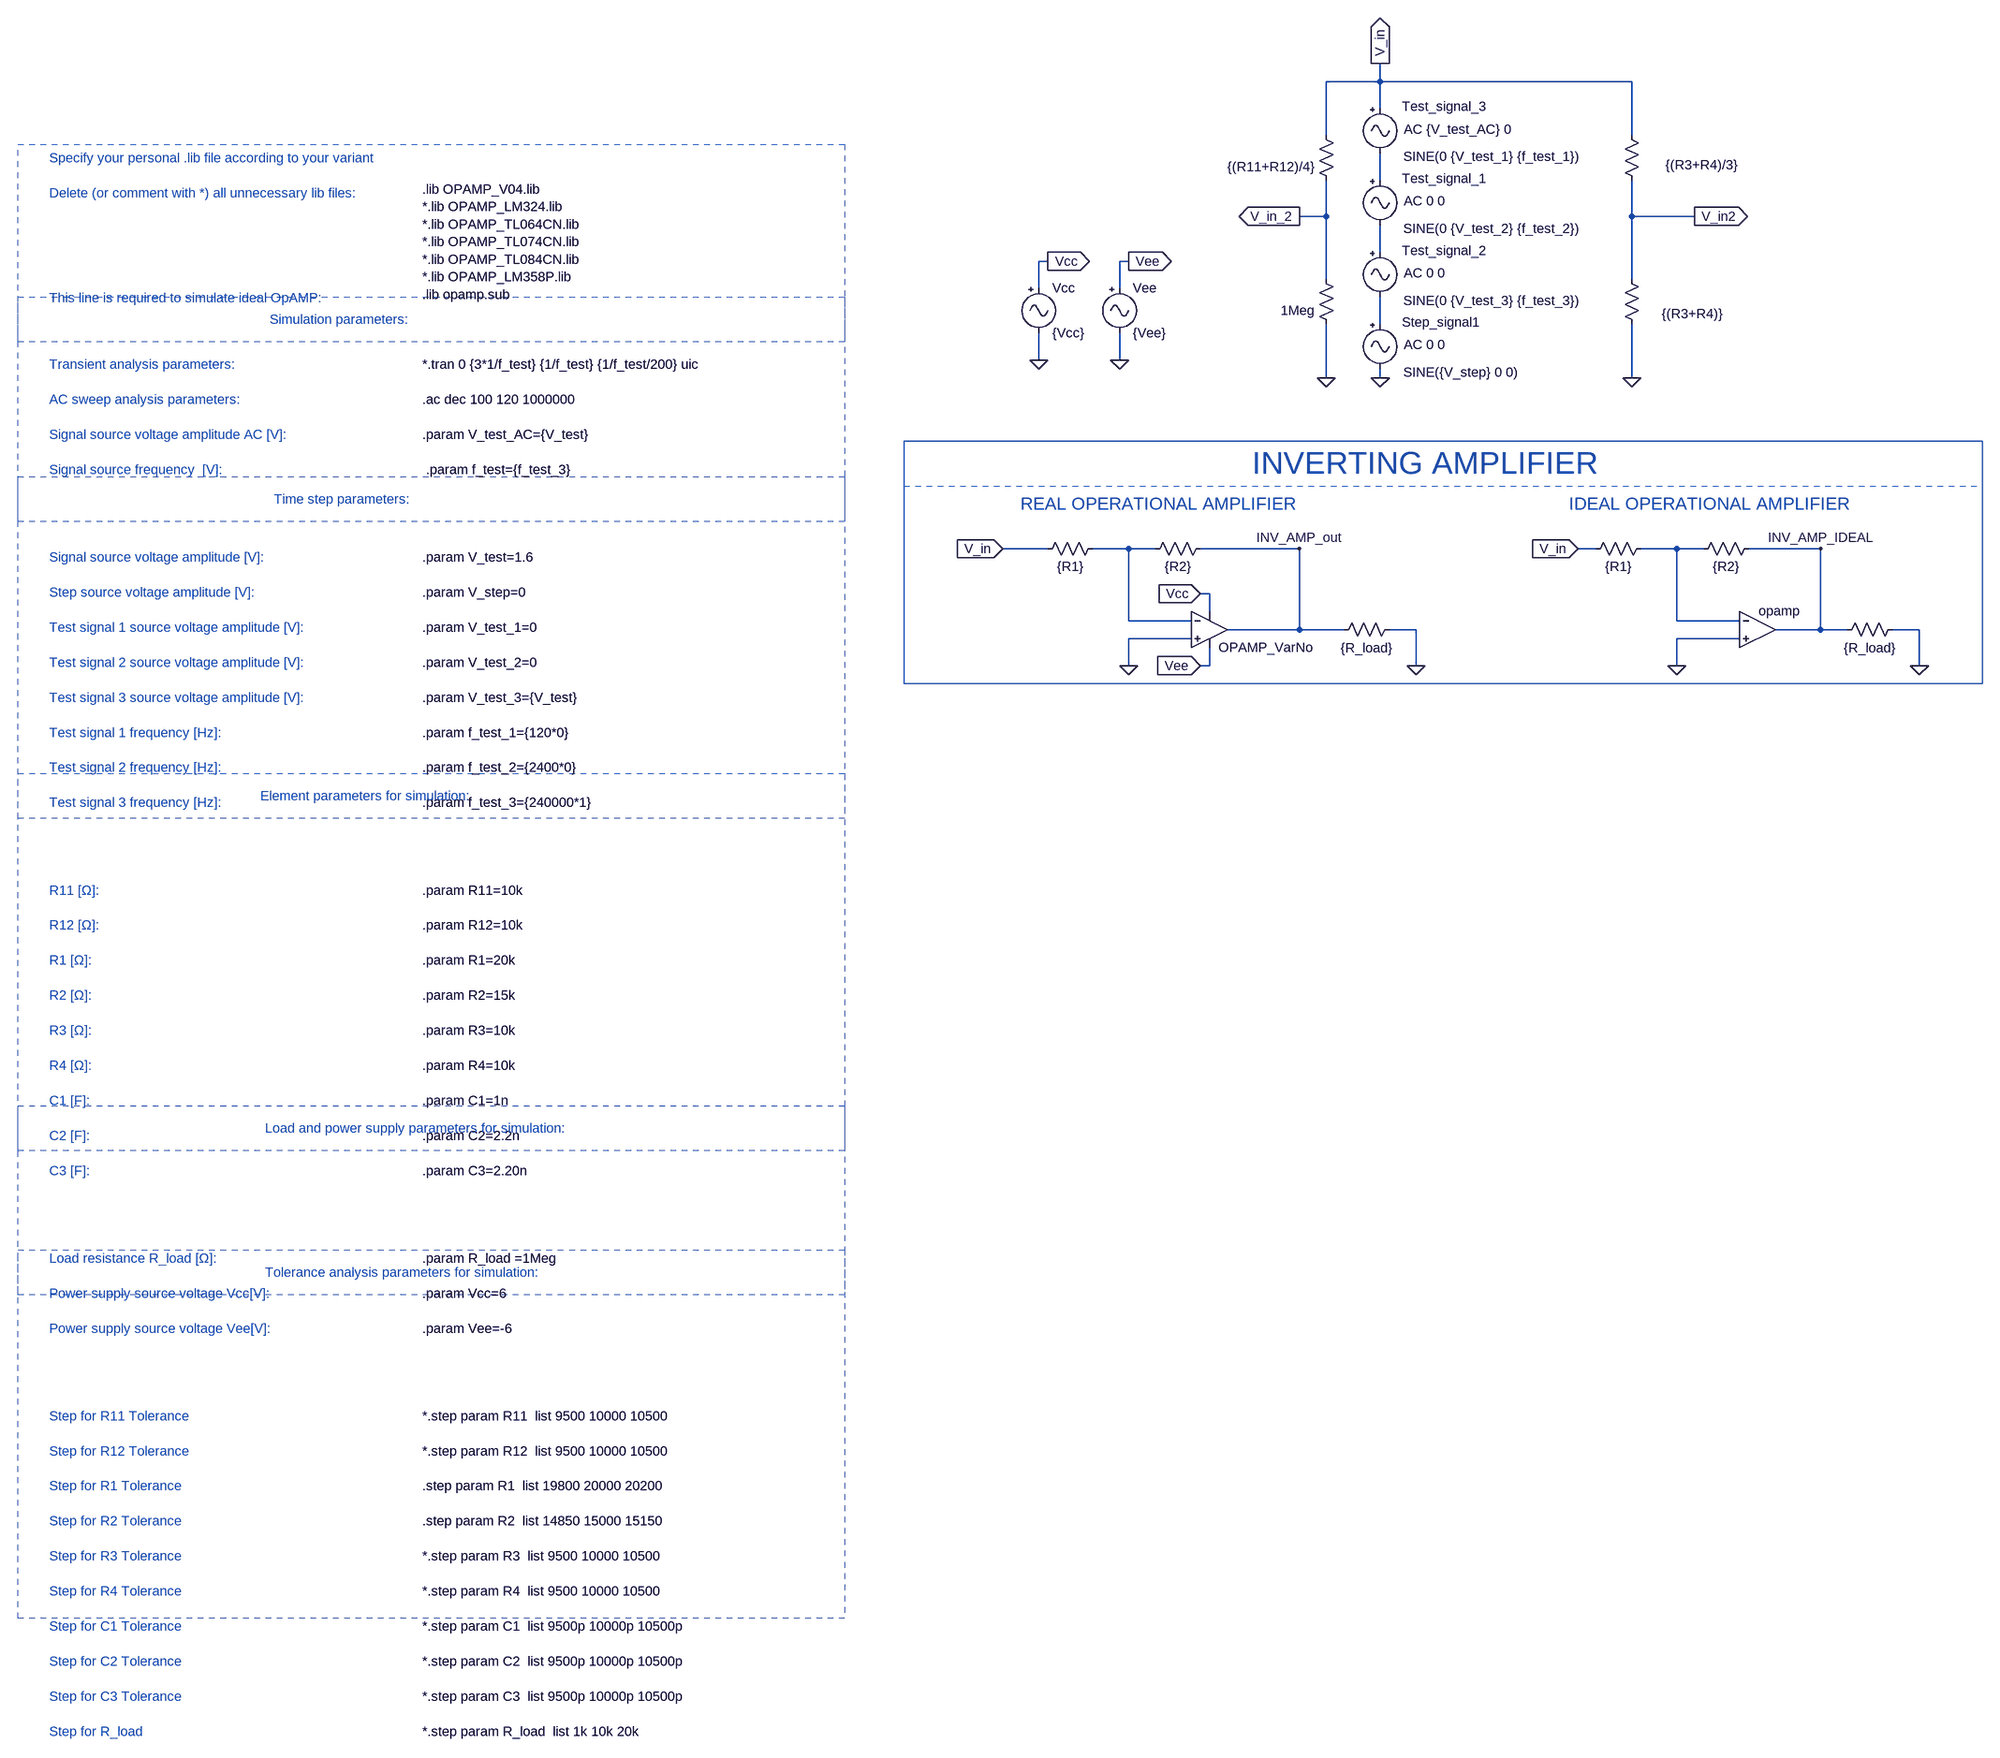
[diagram p0: schematic Lab2. OpAmp_lx.asc]
Lab2. OpAmp_lx.asc, the LTspice schematic file:
Version 4
SHEET 1 3472 3556
WIRE 608 -1040 608 -1072
WIRE 608 -1040 512 -1040
WIRE 1056 -1040 608 -1040
WIRE 608 -992 608 -1040
WIRE 512 -944 512 -1040
WIRE 1056 -944 1056 -1040
WIRE 608 -864 608 -912
WIRE 512 -800 512 -864
WIRE 512 -800 464 -800
WIRE 1056 -800 1056 -864
WIRE 1168 -800 1056 -800
WIRE 608 -736 608 -784
WIRE 16 -720 0 -720
WIRE 160 -720 144 -720
WIRE 512 -688 512 -800
WIRE 1056 -688 1056 -800
WIRE 0 -672 0 -720
WIRE 144 -672 144 -720
WIRE 608 -608 608 -656
WIRE 0 -544 0 -592
WIRE 144 -544 144 -592
WIRE 512 -512 512 -608
WIRE 608 -512 608 -528
WIRE 1056 -512 1056 -608
WIRE 16 -208 -64 -208
WIRE 160 -208 96 -208
WIRE 208 -208 160 -208
WIRE 464 -208 288 -208
WIRE 992 -208 960 -208
WIRE 1136 -208 1072 -208
WIRE 1184 -208 1136 -208
WIRE 1392 -208 1264 -208
WIRE 304 -128 288 -128
WIRE 304 -96 304 -128
WIRE 160 -80 160 -208
WIRE 272 -80 160 -80
WIRE 1136 -80 1136 -208
WIRE 1248 -80 1136 -80
WIRE 464 -64 464 -208
WIRE 464 -64 336 -64
WIRE 544 -64 464 -64
WIRE 672 -64 624 -64
WIRE 1392 -64 1392 -208
WIRE 1392 -64 1312 -64
WIRE 1440 -64 1392 -64
WIRE 1568 -64 1520 -64
WIRE 272 -48 160 -48
WIRE 1248 -48 1136 -48
WIRE 160 0 160 -48
WIRE 304 0 304 -32
WIRE 304 0 288 0
WIRE 672 0 672 -64
WIRE 1136 0 1136 -48
WIRE 1568 0 1568 -64
FLAG 160 0 0
FLAG 288 -128 Vcc
IOPIN 288 -128 In
FLAG 288 0 Vee
IOPIN 288 0 In
FLAG 464 -208 INV_AMP_out
FLAG -64 -208 V_in
IOPIN -64 -208 In
FLAG 1136 0 0
FLAG 1392 -208 INV_AMP_IDEAL
FLAG 960 -208 V_in
IOPIN 960 -208 In
FLAG 672 0 0
FLAG 1568 0 0
FLAG 0 -544 0
FLAG 144 -544 0
FLAG 16 -720 Vcc
IOPIN 16 -720 Out
FLAG 160 -720 Vee
IOPIN 160 -720 Out
FLAG 608 -512 0
FLAG 608 -1072 V_in
IOPIN 608 -1072 Out
FLAG 464 -800 V_in_2
IOPIN 464 -800 Out
FLAG 512 -512 0
FLAG 1056 -512 0
FLAG 1168 -800 V_in2
IOPIN 1168 -800 Out
SYMBOL OpAmps\\opamp2 304 -128 R0
WINDOW 0 16 32 Invisible 2
SYMATTR InstName U1
SYMATTR Value OPAMP_VarNo
SYMBOL res 112 -224 R90
WINDOW 0 0 56 Invisible 2
WINDOW 3 32 56 VTop 2
SYMATTR InstName R1
SYMATTR Value {R1}
SYMATTR SpiceLine tol=10
SYMBOL res 304 -224 R90
WINDOW 0 0 56 Invisible 2
WINDOW 3 32 56 VTop 2
SYMATTR InstName R2
SYMATTR Value {R2}
SYMBOL res 1088 -224 R90
WINDOW 0 0 56 Invisible 2
WINDOW 3 32 56 VTop 2
SYMATTR InstName Ri1
SYMATTR Value {R1}
SYMATTR SpiceLine tol=10
SYMBOL res 1280 -224 R90
WINDOW 0 0 56 Invisible 2
WINDOW 3 32 56 VTop 2
SYMATTR InstName Ri2
SYMATTR Value {R2}
SYMBOL OpAmps\\opamp 1280 -128 R0
WINDOW 0 0 32 Invisible 2
WINDOW 3 2 31 Left 2
SYMATTR InstName U2
SYMBOL res 640 -80 R90
WINDOW 0 0 56 Invisible 2
WINDOW 3 33 56 VTop 2
SYMATTR InstName R5
SYMATTR Value {R_load}
SYMBOL res 1536 -80 R90
WINDOW 0 0 56 Invisible 2
WINDOW 3 33 56 VTop 2
SYMATTR InstName R7
SYMATTR Value {R_load}
SYMBOL Misc\\signal 144 -688 R0
WINDOW 123 0 0 Left 0
WINDOW 39 0 0 Left 0
SYMATTR InstName Vee
SYMATTR Value {Vee}
SYMBOL Misc\\signal 0 -688 R0
WINDOW 123 0 0 Left 0
WINDOW 39 0 0 Left 0
SYMATTR InstName Vcc
SYMATTR Value {Vcc}
SYMBOL Misc\\signal 608 -624 R0
WINDOW 123 42 53 Left 2
WINDOW 39 0 0 Left 0
WINDOW 0 39 13 Left 2
WINDOW 3 41 102 Left 2
SYMATTR Value2 AC 0 0
SYMATTR InstName Step_signal1
SYMATTR Value SINE({V_step} 0 0)
SYMBOL Misc\\signal 608 -880 R0
WINDOW 123 42 53 Left 2
WINDOW 39 0 0 Left 0
WINDOW 0 39 13 Left 2
WINDOW 3 41 102 Left 2
SYMATTR Value2 AC 0 0
SYMATTR InstName Test_signal_1
SYMATTR Value SINE(0 {V_test_2} {f_test_2})
SYMBOL Misc\\signal 608 -752 R0
WINDOW 123 42 53 Left 2
WINDOW 39 0 0 Left 0
WINDOW 0 39 13 Left 2
WINDOW 3 41 102 Left 2
SYMATTR Value2 AC 0 0
SYMATTR InstName Test_signal_2
SYMATTR Value SINE(0 {V_test_3} {f_test_3})
SYMBOL Misc\\signal 608 -1008 R0
WINDOW 123 42 53 Left 2
WINDOW 39 0 0 Left 0
WINDOW 0 39 13 Left 2
WINDOW 3 41 102 Left 2
SYMATTR Value2 AC {V_test_AC} 0
SYMATTR InstName Test_signal_3
SYMATTR Value SINE(0 {V_test_1} {f_test_1})
SYMBOL res 528 -848 R180
WINDOW 0 36 76 Invisible 2
WINDOW 3 36 40 Left 2
SYMATTR InstName R13
SYMATTR Value {(R11+R12)/4}
SYMBOL res 528 -592 R180
WINDOW 0 36 76 Invisible 2
WINDOW 3 36 40 Left 2
SYMATTR InstName R14
SYMATTR Value 1Meg
SYMBOL res 1072 -848 R180
WINDOW 0 -49 76 Invisible 2
WINDOW 3 -173 43 Left 2
SYMATTR InstName R15
SYMATTR Value {(R3+R4)/3}
SYMBOL res 1072 -592 R180
WINDOW 0 -52 66 Invisible 2
WINDOW 3 -146 34 Left 2
SYMATTR InstName R16
SYMATTR Value {(R3+R4)}
TEXT 944 -288 Left 3 ;IDEAL OPERATIONAL AMPLIFIER
TEXT -32 -288 Left 3 ;REAL OPERATIONAL AMPLIFIER
TEXT 688 -360 Center 5 ;INVERTING AMPLIFIER
TEXT -1104 -536 Left 2 !*.tran 0 {3*1/f_test} {1/f_test} {1/f_test/200} uic\n  \n.ac dec 100 120 1000000\n \n.param V_test_AC={V_test}\n \n .param f_test={f_test_3}\n \n \n \n \n.param V_test=1.6\n \n.param V_step=0\n \n.param V_test_1=0\n \n.param V_test_2=0\n \n.param V_test_3={V_test}\n \n.param f_test_1={120*0}\n \n.param f_test_2={2400*0}\n \n.param f_test_3={240000*1}\n \n \n  \n \n.param R11=10k\n  \n.param R12=10k\n \n.param R1=20k\n \n.param R2=15k\n \n.param R3=10k\n \n.param R4=10k\n \n.param C1=1n\n \n.param C2=2.2n\n \n.param C3=2.20n\n \n \n \n \n.param R_load =1Meg\n \n.param Vcc=6\n \n.param Vee=-6\n \n \n \n  \n*.step param R11  list 9500 10000 10500 \n \n*.step param R12  list 9500 10000 10500 \n  \n.step param R1  list 19800 20000 20200 \n \n.step param R2  list 14850 15000 15150\n \n*.step param R3  list 9500 10000 10500\n \n*.step param R4  list 9500 10000 10500\n \n*.step param C1  list 9500p 10000p 10500p\n \n*.step param C2  list 9500p 10000p 10500p\n \n*.step param C3  list 9500p 10000p 10500p\n \n*.step param R_load  list 1k 10k 20k
TEXT -1104 -848 Left 2 !.lib OPAMP_V04.lib\n*.lib OPAMP_LM324.lib\n*.lib OPAMP_TL064CN.lib\n*.lib OPAMP_TL074CN.lib\n*.lib OPAMP_TL084CN.lib\n*.lib OPAMP_LM358P.lib \n.lib opamp.sub
TEXT -1768 -904 Left 2 ;Specify your personal .lib file according to your variant\n \nDelete (or comment with *) all unnecessary lib files:\n \n \n \n  \n \nThis line is required to simulate ideal OpAMP:
TEXT -1376 -616 Left 2 ;Simulation parameters:
TEXT -1392 232 Left 2 ;Element parameters for simulation:
TEXT -1768 -536 Left 2 ;Transient analysis parameters:\n \nAC sweep analysis parameters:\n \nSignal source voltage amplitude AC [V]: \n \nSignal source frequency  [V]:  \n \n \n \n \nSignal source voltage amplitude [V]:\n \nStep source voltage amplitude [V]:\n \nTest signal 1 source voltage amplitude [V]:\n \nTest signal 2 source voltage amplitude [V]:\n \nTest signal 3 source voltage amplitude [V]:\n \nTest signal 1 frequency [Hz]:\n \nTest signal 2 frequency [Hz]:\n \nTest signal 3 frequency [Hz]:\n \n \n  \n  \nR11 [Ω]:\n \nR12 [Ω]:\n \nR1 [Ω]:\n \nR2 [Ω]:\n \nR3 [Ω]:\n \nR4 [Ω]:\n \nC1 [F]:\n \nC2 [F]:\n \nC3 [F]:\n \n \n \n \nLoad resistance R_load [Ω]:\n \nPower supply source voltage Vcc[V]:\n \nPower supply source voltage Vee[V]: \n \n \n \n \nStep for R11 Tolerance\n \nStep for R12 Tolerance \n \nStep for R1 Tolerance\n \nStep for R2 Tolerance\n \nStep for R3 Tolerance\n \nStep for R4 Tolerance \n \nStep for C1 Tolerance \n \nStep for C2 Tolerance\n \nStep for C3 Tolerance \n \nStep for R_load
TEXT -1368 -296 Left 2 ;Time step parameters:
TEXT -1384 824 Left 2 ;Load and power supply parameters for simulation:
TEXT -1384 1080 Left 2 ;Tolerance analysis parameters for simulation:
RECTANGLE Normal 1680 32 -240 -320 2
RECTANGLE Normal 1680 32 -240 -400
RECTANGLE Normal -352 -576 -1824 -656 2
RECTANGLE Normal -352 272 -1824 192 2
RECTANGLE Normal -352 864 -1824 784 2
RECTANGLE Normal -352 -256 -1824 -336 2
RECTANGLE Normal -352 1120 -1824 1040 2
RECTANGLE Normal -352 1696 -1824 -928 2

The netlist it stands for:
* Lab2. OpAmp_lx.asc
XU1 0 N004 Vcc Vee INV_AMP_out OPAMP_VarNo  ; pins In+ In- V+ V- OUT
R1 N004 V_in {R1} tol=10
R2 INV_AMP_out N004 {R2}
Ri1 N005 V_in {R1} tol=10
Ri2 INV_AMP_IDEAL N005 {R2}
XU2 N005 0 INV_AMP_IDEAL opamp Aol=100K GBW=10Meg  ; pins invin noninvin out
R5 0 INV_AMP_out {R_load}
R7 0 INV_AMP_IDEAL {R_load}
Vee Vee 0 {Vee}
Vcc Vcc 0 {Vcc}
V§Step_signal1 N003 0 SINE({V_step} 0 0) AC 0 0
V§Test_signal_1 N001 N002 SINE(0 {V_test_2} {f_test_2}) AC 0 0
V§Test_signal_2 N002 N003 SINE(0 {V_test_3} {f_test_3}) AC 0 0
V§Test_signal_3 V_in N001 SINE(0 {V_test_1} {f_test_1}) AC {V_test_AC} 0
R13 V_in_2 V_in {(R11+R12)/4}
R14 0 V_in_2 1Meg
R15 V_in2 V_in {(R3+R4)/3}
R16 0 V_in2 {(R3+R4)}
* IDEAL OPERATIONAL AMPLIFIER
* REAL OPERATIONAL AMPLIFIER
* INVERTING AMPLIFIER
*.tran 0 {3*1/f_test} {1/f_test} {1/f_test/200} uic
.ac dec 100 120 1000000
.param V_test_AC={V_test}
 .param f_test={f_test_3}
.param V_test=1.6
.param V_step=0
.param V_test_1=0
.param V_test_2=0
.param V_test_3={V_test}
.param f_test_1={120*0}
.param f_test_2={2400*0}
.param f_test_3={240000*1}
.param R11=10k
.param R12=10k
.param R1=20k
.param R2=15k
.param R3=10k
.param R4=10k
.param C1=1n
.param C2=2.2n
.param C3=2.20n
.param R_load =1Meg
.param Vcc=6
.param Vee=-6
*.step param R11  list 9500 10000 10500
*.step param R12  list 9500 10000 10500
.step param R1  list 19800 20000 20200
.step param R2  list 14850 15000 15150
*.step param R3  list 9500 10000 10500
*.step param R4  list 9500 10000 10500
*.step param C1  list 9500p 10000p 10500p
*.step param C2  list 9500p 10000p 10500p
*.step param C3  list 9500p 10000p 10500p
*.step param R_load  list 1k 10k 20k
.lib OPAMP_V04.lib
*.lib OPAMP_LM324.lib
*.lib OPAMP_TL064CN.lib
*.lib OPAMP_TL074CN.lib
*.lib OPAMP_TL084CN.lib
*.lib OPAMP_LM358P.lib
.lib opamp.sub
* Specify your personal .lib file according to your variant
* Delete (or comment with *) all unnecessary lib files:
* This line is required to simulate ideal OpAMP:
* Simulation parameters:
* Element parameters for simulation:
* Transient analysis parameters:
* AC sweep analysis parameters:
* Signal source voltage amplitude AC [V]:
* Signal source frequency  [V]:
* Signal source voltage amplitude [V]:
* Step source voltage amplitude [V]:
* Test signal 1 source voltage amplitude [V]:
* Test signal 2 source voltage amplitude [V]:
* Test signal 3 source voltage amplitude [V]:
* Test signal 1 frequency [Hz]:
* Test signal 2 frequency [Hz]:
* Test signal 3 frequency [Hz]:
* R11 [Ω]:
* R12 [Ω]:
* R1 [Ω]:
* R2 [Ω]:
* R3 [Ω]:
* R4 [Ω]:
* C1 [F]:
* C2 [F]:
* C3 [F]:
* Load resistance R_load [Ω]:
* Power supply source voltage Vcc[V]:
* Power supply source voltage Vee[V]:
* Step for R11 Tolerance
* Step for R12 Tolerance
* Step for R1 Tolerance
* Step for R2 Tolerance
* Step for R3 Tolerance
* Step for R4 Tolerance
* Step for C1 Tolerance
* Step for C2 Tolerance
* Step for C3 Tolerance
* Step for R_load
* Time step parameters:
* Load and power supply parameters for simulation:
* Tolerance analysis parameters for simulation:
.backanno
.end